# Altium schematic sheet led.SchDoc
size A4
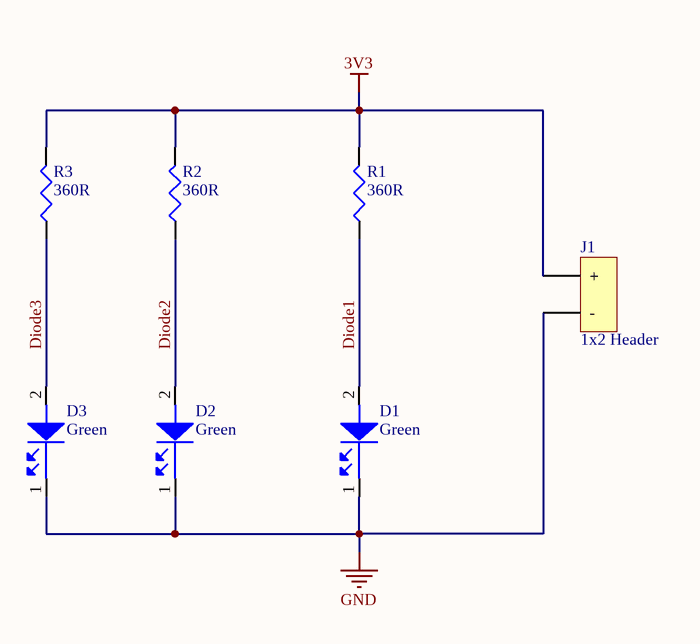
[diagram p0: led.SchDoc]

## Parts
D1  Green  [LED0603G]
D2  Green  [LED0603G]
D3  Green  [LED0603G]
J1  1x2 Header  [Header 1X2]
R1  360R  [Resistor]
R2  360R  [Resistor]
R3  360R  [Resistor]

## Nets
3V3: J1.1(+) R1.2 R2.2 R3.2
GND: D1.1 D2.1 D3.1 J1.2(-)
Diode1: D1.2 R1.1
Diode2: D2.2 R2.1
Diode3: D3.2 R3.1

## Library data of the parts
D1-D3 = TLMG1100-GS08: Standard LEDs - SMD Green Non-Diffused; Manufacturer: Vishay Semiconductors; Voltage Rating (DC): 3V; Number of LEDs: 1; Viewing Angle: 160°; Lens Style: Rectangular,Diffused; Luminous Intensity: 35mcd; Forward Current: 20mA; Forward Voltage: 2.1V; Wavelength: 570nm; Power Rating: 90mW; Reverse Voltage: 6V; Supplier 1: Digi-Key; Supplier Part Number 1: 751-1165-1-ND; Manufacturer Part Number: TLMG1100-GS08; RoHS: Yes; Category: Optoelectronics; Stock 1: 62041; Pricing 1: 1=0,47000, 10=0,33900, 100=0,22110, 500=0,15894, 1000=0,12438 (USD); Mount: Surface Mount,PCB; Case/Package: 0603; Number of Pins: 2; Case Code (Metric): 1608; Contact Plating: Gold; Color: Green; Case Code (Imperial): 0603; Min Operating Temperature: -40°C; Max Operating Temperature: 100°C; Packaging: Tape and Reel; Package Quantity: 1; Illumination Color: Green; Dominant Wavelength: 570nm; Test Current: 20mA; Number of Elements: 1; Power Dissipation: 90mW; Max Power Dissipation: 90mW; Length: 1.6mm; Height: 0.65mm; Width: 0.8mm; Depth: 0.8mm; Radiation Hardening: No; Lead Free: Lead Free; REACH SVHC: Unknown; ComponentLink1URL: https://datasheet.ciiva.com/11773/0900766b80ed1fab-11773829.pdf?src-supplier=RSComponents; ComponentLink1Description: https://datasheet.ciiva.com/11773/0900766b80ed1fab-11773829.pdf?src-supplier=RSComponents; ComponentLink2URL: https://datasheet.ciiva.com/15118/getdatasheetpartid-196748-15118054.pdf?src-supplier=Verical; ComponentLink2Description: https://datasheet.ciiva.com/15118/getdatasheetpartid-196748-15118054.pdf?src-supplier=Verical; ComponentLink3URL: https://datasheet.ciiva.com/2109/tlmb1100-2109920.pdf?src-supplier=Digi-Key; ComponentLink3Description: https://datasheet.ciiva.com/2109/tlmb1100-2109920.pdf?src-supplier=Digi-Key; ComponentLink4URL: https://datasheet.ciiva.com/16299/tlmb1100-16299239.pdf?src-supplier=Future+Electronics; ComponentLink4Description: https://datasheet.ciiva.com/16299/tlmb1100-16299239.pdf?src-supplier=Future+Electronics; ComponentLink5URL: https://datasheet.ciiva.com/2109/tlmb1100-2109919.pdf?src-supplier=Digi-Key; ComponentLink5Description: https://datasheet.ciiva.com/2109/tlmb1100-2109919.pdf?src-supplier=Digi-Key; ComponentLink6URL: https://datasheet.ciiva.com/5798/485053-5798326.pdf?src-supplier=Farnell; ComponentLink6Description: https://datasheet.ciiva.com/5798/485053-5798326.pdf?src-supplier=Farnell; ComponentLink7URL: https://datasheet.ciiva.com/3166/tlmb1100-3166935.pdf?src-supplier=Avnet; ComponentLink7Description: https://datasheet.ciiva.com/3166/tlmb1100-3166935.pdf?src-supplier=Avnet; ComponentLink8URL: https://datasheet.ciiva.com/3166/tlmb1100-3166505.pdf?src-supplier=Avnet; ComponentLink8Description: https://datasheet.ciiva.com/3166/tlmb1100-3166505.pdf?src-supplier=Avnet; ComponentLink9URL: https://datasheet.ciiva.com/22655/1911389-22655641.pdf?src-supplier=Element14; ComponentLink9Description: https://datasheet.ciiva.com/22655/1911389-22655641.pdf?src-supplier=Element14; ComponentLink10URL: https://datasheet.ciiva.com/2109/tlmb1100-2109921.pdf?src-supplier=Digi-Key; ComponentLink10Description: https://datasheet.ciiva.com/2109/tlmb1100-2109921.pdf?src-supplier=Digi-Key; ComponentLink11URL: https://datasheet.ciiva.com/22655/1911389-22655622.pdf?src-supplier=Element14; ComponentLink11Description: https://datasheet.ciiva.com/22655/1911389-22655622.pdf?src-supplier=Element14; ComponentLink12URL: https://datasheet.ciiva.com/5798/tlmb1100-5798250.pdf?src-supplier=Farnell; ComponentLink12Description: https://datasheet.ciiva.com/5798/tlmb1100-5798250.pdf?src-supplier=Farnell; ComponentLink13URL: https://datasheet.ciiva.com/8027/485053-8027918.pdf?src-supplier=Element14; ComponentLink13Description: https://datasheet.ciiva.com/8027/485053-8027918.pdf?src-supplier=Element14
J1 = 22-29-2021: Conn Wire to Board HDR 2 POS 2.54mm Solder ST Thru-Hole Bag; Manufacturer: Molex; Number of Positions: 2; Connector Type: Header,Male Pin; Gender: Male; Voltage Rating (DC): 250V; Contact Post Length: 0.14inch; Glow Wire Compliant: Non-compliant; Supplier 1: Digi-Key; Manufacturer Part Number: 22-29-2021; RoHS: Yes; Category: Connectors; Stock 1: 6727; Pricing 1: 1=0,48000, 10=0,45200, 100=0,31630, 500=0,27112, 1000=0,22593, 5000=0,19365, 10000=0,18074 (USD); Mount: Through Hole; Color: White; Contact Plating: Gold; Contact Material: Brass; Contact Shape: Square; Insulation Material: Nylon; Insulation Color: Natural; Max Operating Temperature: 80°C; Number of Rows: 1; Packaging: Bag; Termination: Solder; Fastening Type: Friction; Contact Mating Length: 0.295inch; Insulation Height: 0.461inch; Lead Free: Lead Free; Halogen Free: Low Halogen; Flammability Rating: UL94 V-0; ComponentLink1URL: https://datasheet.ciiva.com/70131/022292021-sd-70131706.pdf?src-supplier=Digi-Key; ComponentLink1Description: https://datasheet.ciiva.com/70131/022292021-sd-70131706.pdf?src-supplier=Digi-Key; Supplier Part Number 1: WM2744-ND
R1-R3 = CRCW0805360RFKEA: Res Thick Film 0805 360 Ohm 1% 0.125W(1/8W) ±100ppm/C Molded SMD Automotive Paper T/R; Manufacturer: Vishay; Temperature Coefficient: 100ppm/°C; Max Power Dissipation: 125mW; Voltage Rating (DC): 150V; Supplier 1: Digi-Key; Supplier Part Number 1: 541-360CCT-ND; Manufacturer Part Number: CRCW0805360RFKEA; RoHS: Yes; Category: Resistances; Stock 1: 14278; Pricing 1: 1=0,10000, 10=0,06200, 100=0,02540, 1000=0,01142, 2500=0,00991 (USD); Case/Package: 0805; Number of Pins: 2; Weight: 0.000194oz; Case Code (Metric): 2012; Case Code (Imperial): 0805; Contact Plating: Tin; Number of Terminals: 2; Min Operating Temperature: -55°C; Max Operating Temperature: 155°C; Resistance: 360R; Tolerance: 1%; Packaging: Tape and Reel; Composition: Thick Film; Package Quantity: 10; Number of Terminations: 2; Features: Automotive AEC-Q200; Power Rating: 125mW; Voltage Rating: 150V; Termination: SMD/SMT; Military Standard: Not; Length: 2mm; Height: 0.45mm; Width: 0.049inch; Depth: 1.25mm; Radiation Hardening: No; Lead Free: Lead Free; REACH SVHC: Unknown; ComponentLink1URL: https://datasheet.ciiva.com/2467/dcrcwe3-2467773.pdf?src-supplier=Digi-Key; ComponentLink1Description: https://datasheet.ciiva.com/2467/dcrcwe3-2467773.pdf?src-supplier=Digi-Key